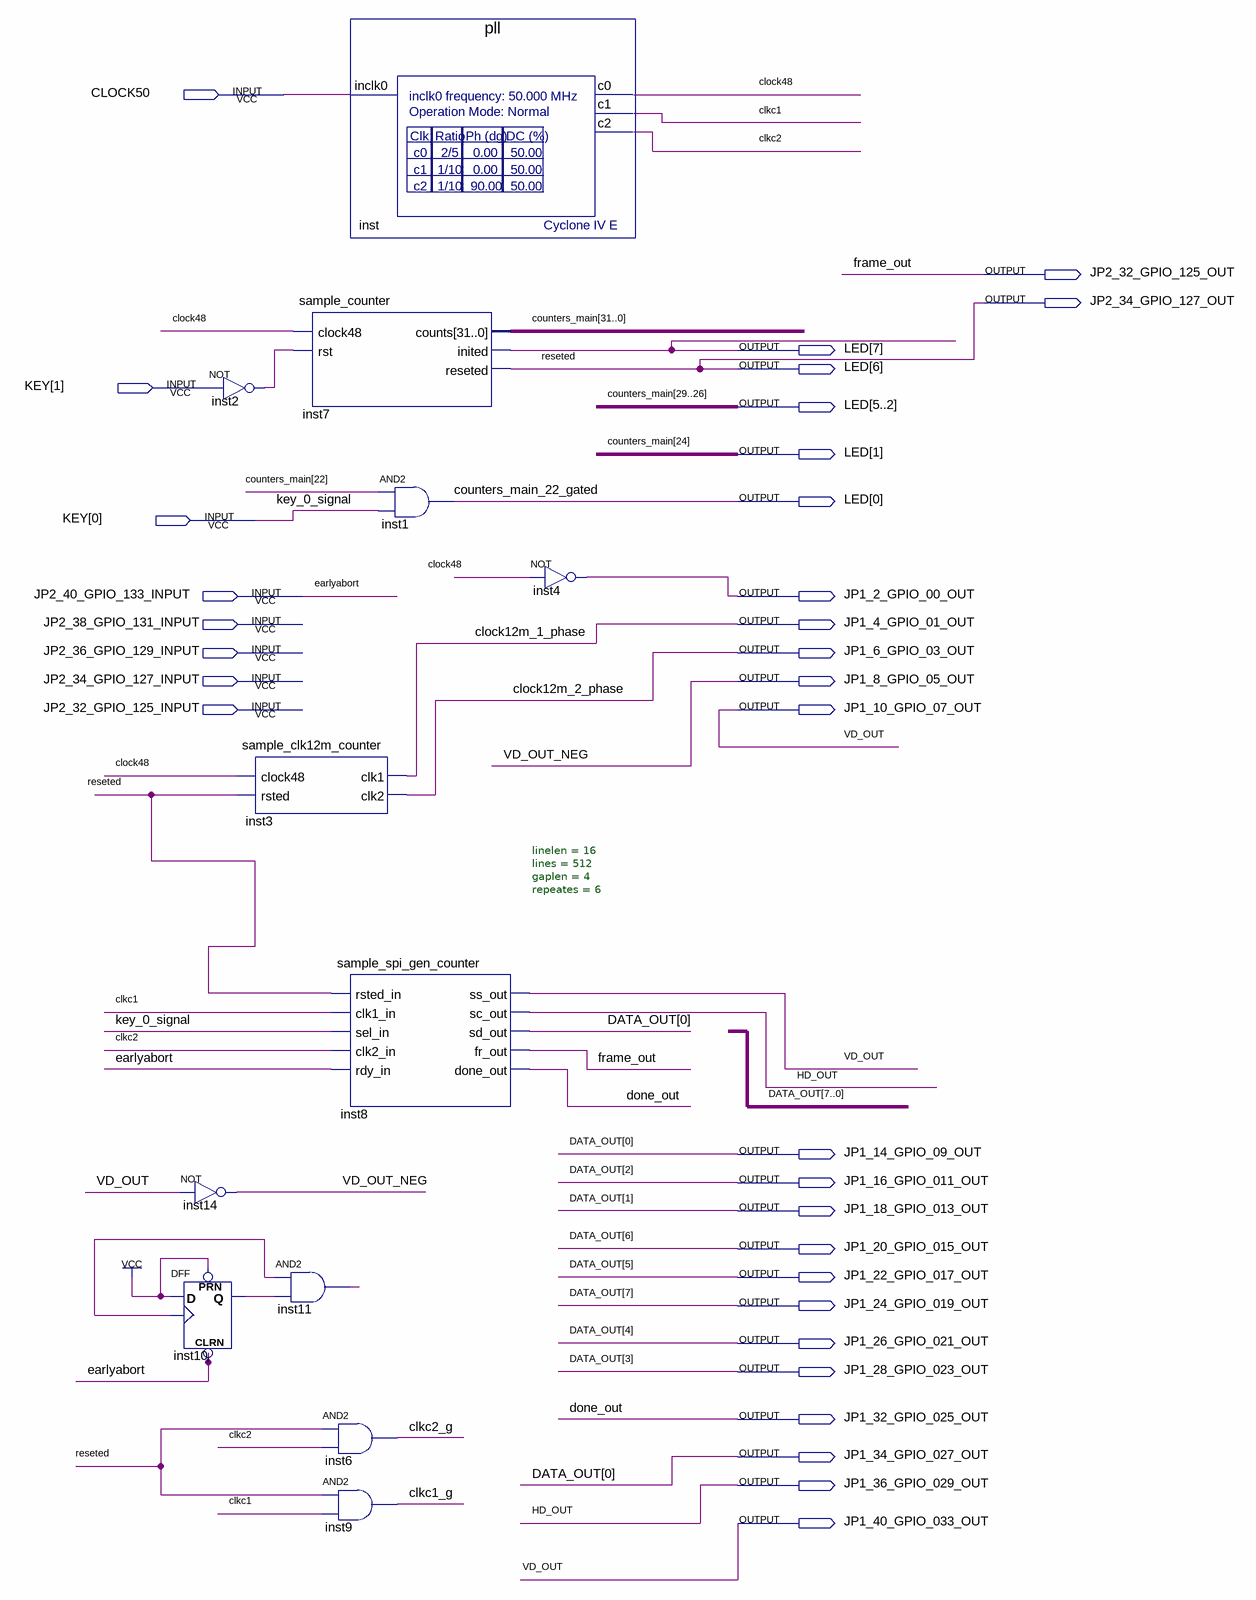
[diagram p0: schematic sheet]
// Quartus schematic spi_xgen_top.bdf as structural Verilog: 12 symbols, 32 pins
module spi_xgen_top (
  input  CLOCK50,
  input  [1:0] KEY,
  input  JP2_40_GPIO_133_INPUT,
  input  JP2_38_GPIO_131_INPUT,
  input  JP2_36_GPIO_129_INPUT,
  input  JP2_34_GPIO_127_INPUT,
  input  JP2_32_GPIO_125_INPUT,
  output JP2_32_GPIO_125_OUT,
  output JP2_34_GPIO_127_OUT,
  output [7:0] LED,
  output JP1_2_GPIO_00_OUT,
  output JP1_4_GPIO_01_OUT,
  output JP1_6_GPIO_03_OUT,
  output JP1_8_GPIO_05_OUT,
  output JP1_10_GPIO_07_OUT,
  output JP1_14_GPIO_09_OUT,
  output JP1_16_GPIO_011_OUT,
  output JP1_18_GPIO_013_OUT,
  output JP1_20_GPIO_015_OUT,
  output JP1_22_GPIO_017_OUT,
  output JP1_24_GPIO_019_OUT,
  output JP1_26_GPIO_021_OUT,
  output JP1_28_GPIO_023_OUT,
  output JP1_32_GPIO_025_OUT,
  output JP1_34_GPIO_027_OUT,
  output JP1_36_GPIO_029_OUT,
  output JP1_40_GPIO_033_OUT
);

  wire clkc1, clkc1_g, clkc2, clkc2_g, clock48, inst2_out, inst10_q, inst11_out, undriven;
  wire [31:0] counters_main;

  not inst2 (inst2_out, KEY[1]);
  not inst14 (JP1_8_GPIO_05_OUT, JP1_10_GPIO_07_OUT);
  DFF inst10 (.CLRN(JP2_40_GPIO_133_INPUT), .CLK(undriven), .D(1'b1), .PRN(1'b1), .Q(inst10_q));
  sample_counter inst7 (
    .clock48(clock48), .rst(inst2_out),
    .counts({counters_main[31:30], LED[5:2], counters_main[25], LED[1], counters_main[23:0]}),
    .inited(LED[7]), .reseted(JP2_34_GPIO_127_OUT));
  sample_clk12m_counter inst3 (
    .clock48(clock48), .rsted(JP2_34_GPIO_127_OUT), .clk1(JP1_4_GPIO_01_OUT), .clk2(JP1_6_GPIO_03_OUT));
  and inst11 (inst11_out, undriven, inst10_q);
  pll inst (.inclk0(CLOCK50), .c0(clock48), .c1(clkc1), .c2(clkc2));
  and inst1 (LED[0], counters_main[22], KEY[0]);
  sample_spi_gen_counter #(.linelen(16), .lines(512), .gaplen(4), .repeates(6)) inst8 (
    .rsted_in(JP2_34_GPIO_127_OUT), .clk1_in(clkc1), .sel_in(KEY[0]), .clk2_in(clkc2),
    .rdy_in(JP2_40_GPIO_133_INPUT), .ss_out(JP1_10_GPIO_07_OUT), .sc_out(JP1_36_GPIO_029_OUT),
    .sd_out(JP1_14_GPIO_09_OUT), .fr_out(JP2_32_GPIO_125_OUT), .done_out(JP1_32_GPIO_025_OUT));
  and inst6 (clkc2_g, JP2_34_GPIO_127_OUT, clkc2);
  and inst9 (clkc1_g, JP2_34_GPIO_127_OUT, clkc1);
  not inst4 (JP1_2_GPIO_00_OUT, clock48);

  assign JP1_34_GPIO_027_OUT = JP1_14_GPIO_09_OUT;
  assign JP1_40_GPIO_033_OUT = JP1_10_GPIO_07_OUT;
  assign LED[6] = JP2_34_GPIO_127_OUT;

  // Other names for the same wires on the sheet: counters_main (some bits) = LED[5:1];
  //   counters_main_22_gated = LED[0];
  //   DATA_OUT[7:0] = {JP1_24_GPIO_019_OUT, JP1_20_GPIO_015_OUT, JP1_22_GPIO_017_OUT, JP1_26_GPIO_021_OUT, JP1_28_GPIO_023_OUT, JP1_16_GPIO_011_OUT, JP1_18_GPIO_013_OUT, JP1_14_GPIO_09_OUT};
  //   done_out = JP1_32_GPIO_025_OUT; earlyabort = JP2_40_GPIO_133_INPUT; frame_out = JP2_32_GPIO_125_OUT;
  //   clock12m_1_phase = JP1_4_GPIO_01_OUT; clock12m_2_phase = JP1_6_GPIO_03_OUT; VD_OUT = JP1_10_GPIO_07_OUT;
  //   HD_OUT = JP1_36_GPIO_029_OUT; reseted = JP2_34_GPIO_127_OUT; key_0_signal = KEY[0];
  //   VD_OUT_NEG = JP1_8_GPIO_05_OUT
endmodule
